# Altium schematic sheet StairMastersPDB.SchDoc
size 863 x 558 mm; SheetNumber: 1; SheetTotal: 1; SPICEModelCacheZXQFRXWD: <root> / <DocumentId>ZXQFRXWD</DocumentId> / </root>
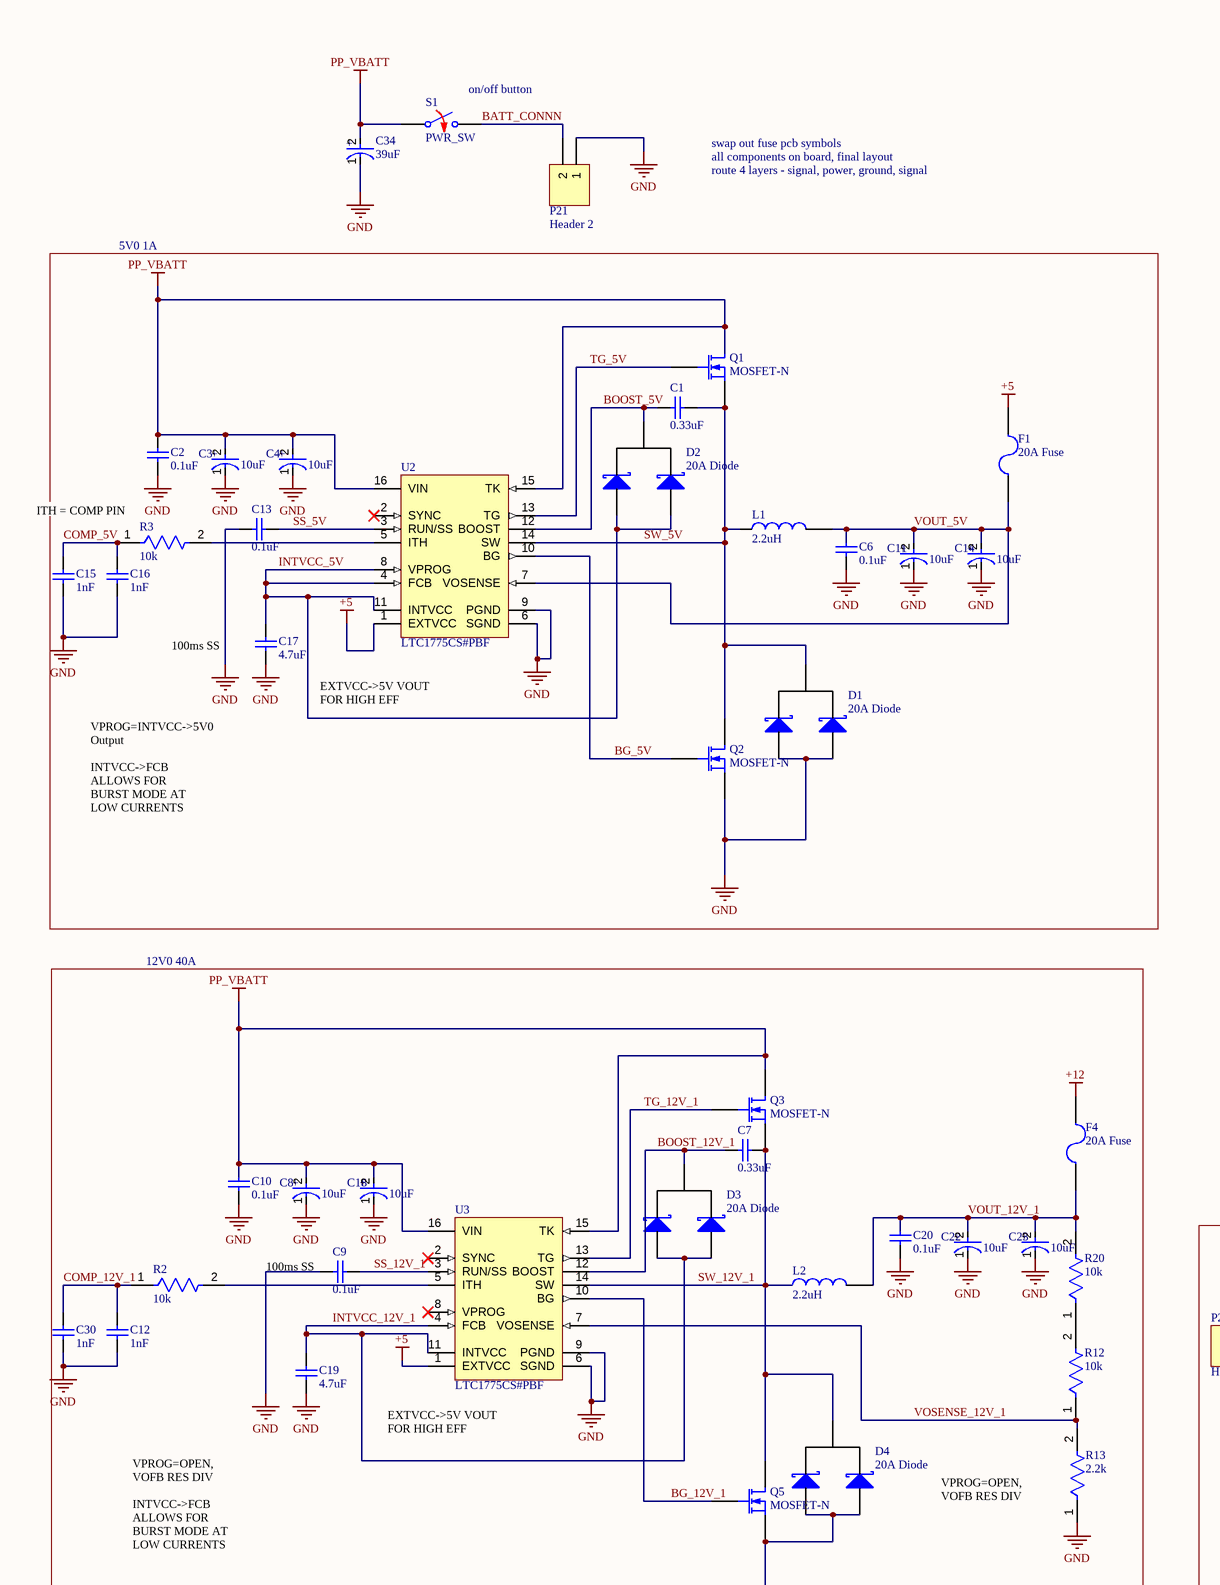
[diagram p0: StairMastersPDB.SchDoc, top left]
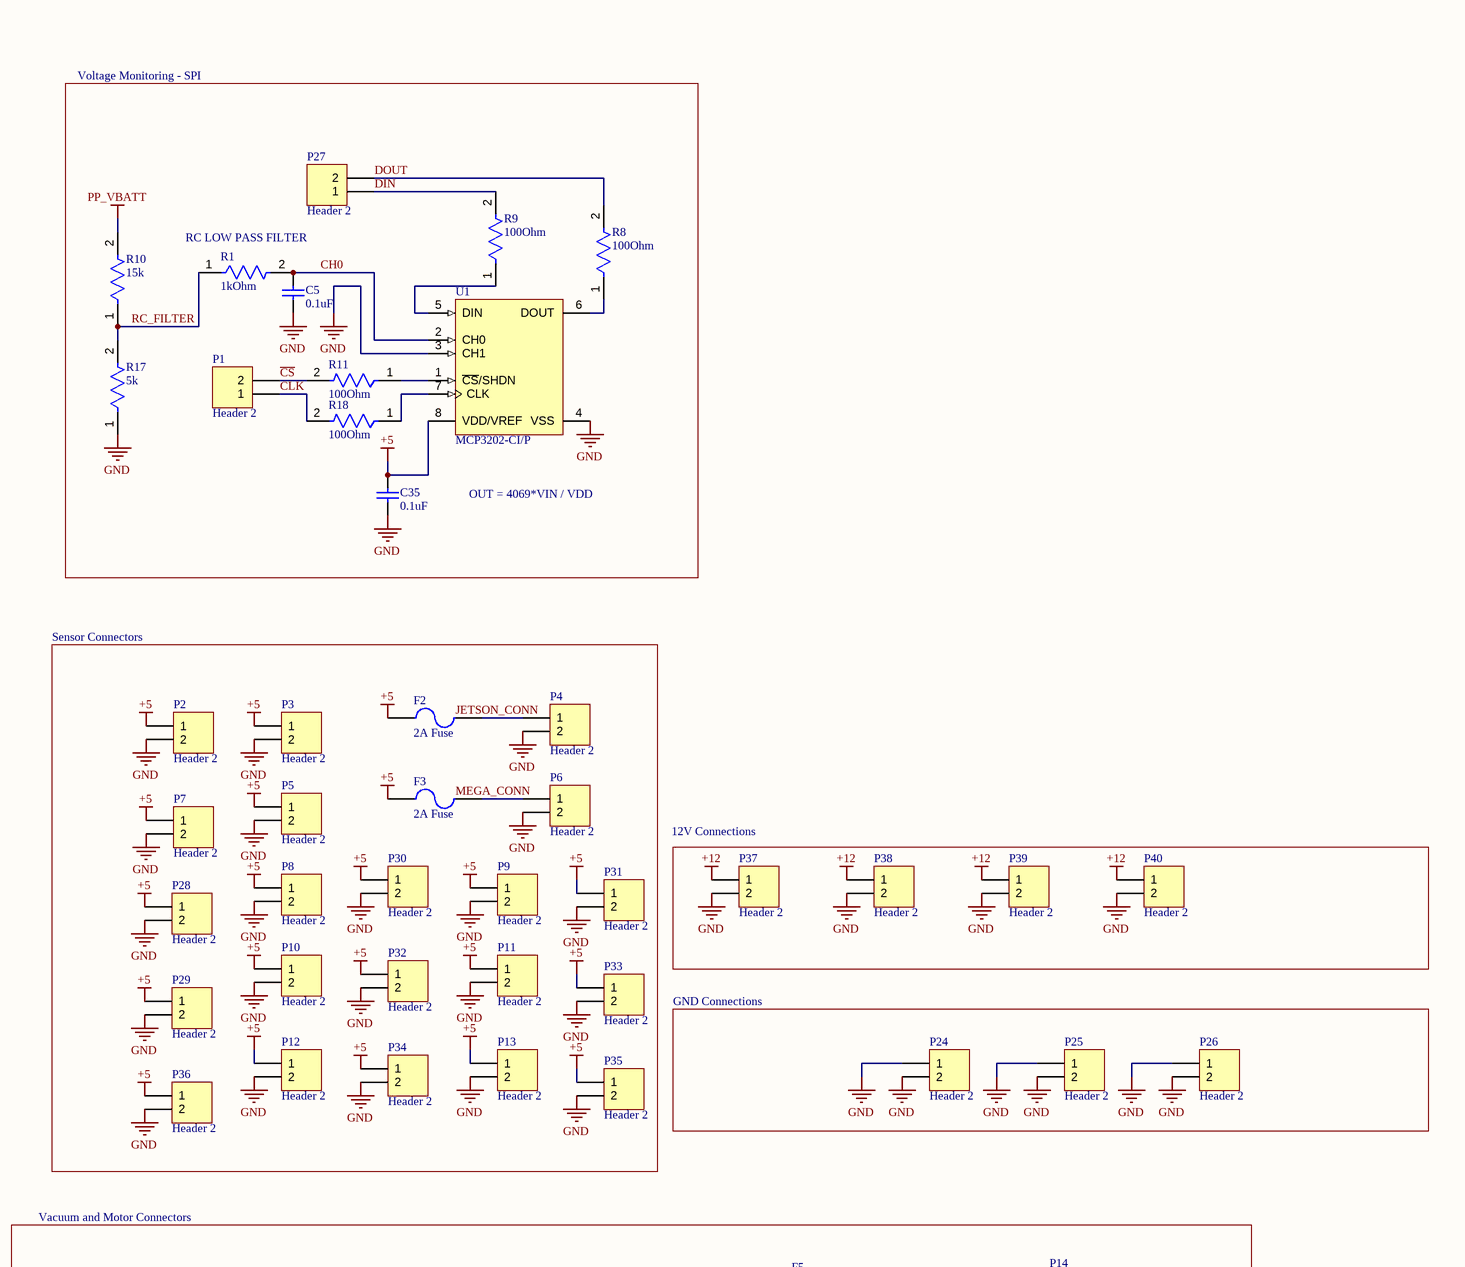
[diagram p1: StairMastersPDB.SchDoc, top right]
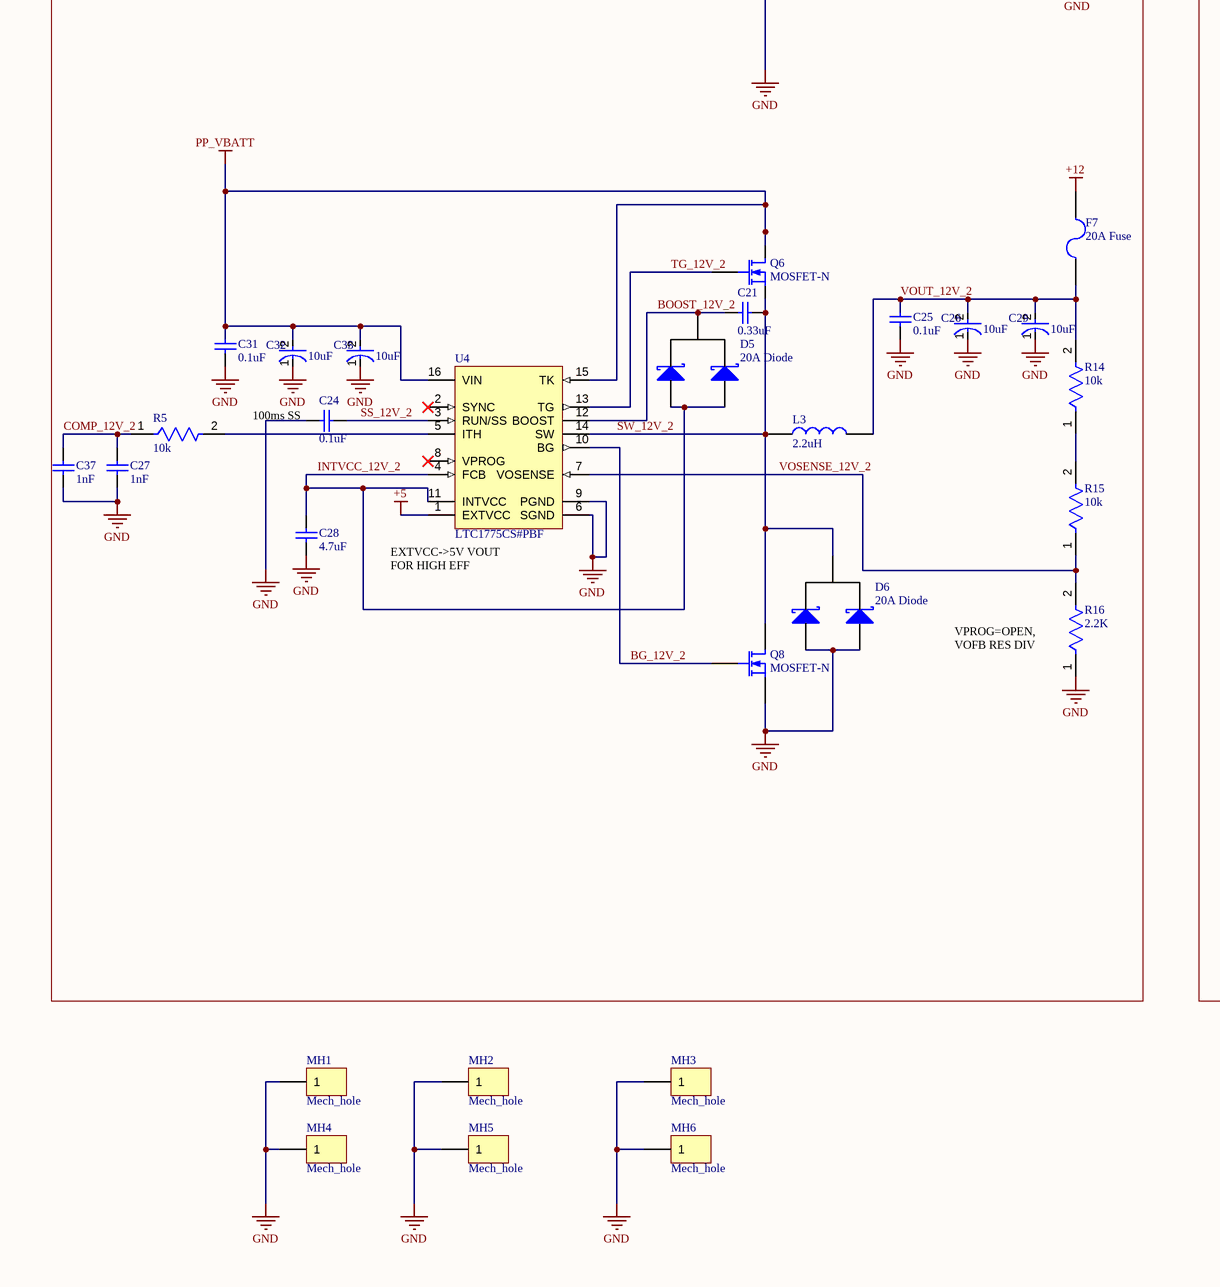
[diagram p2: StairMastersPDB.SchDoc, bottom left]
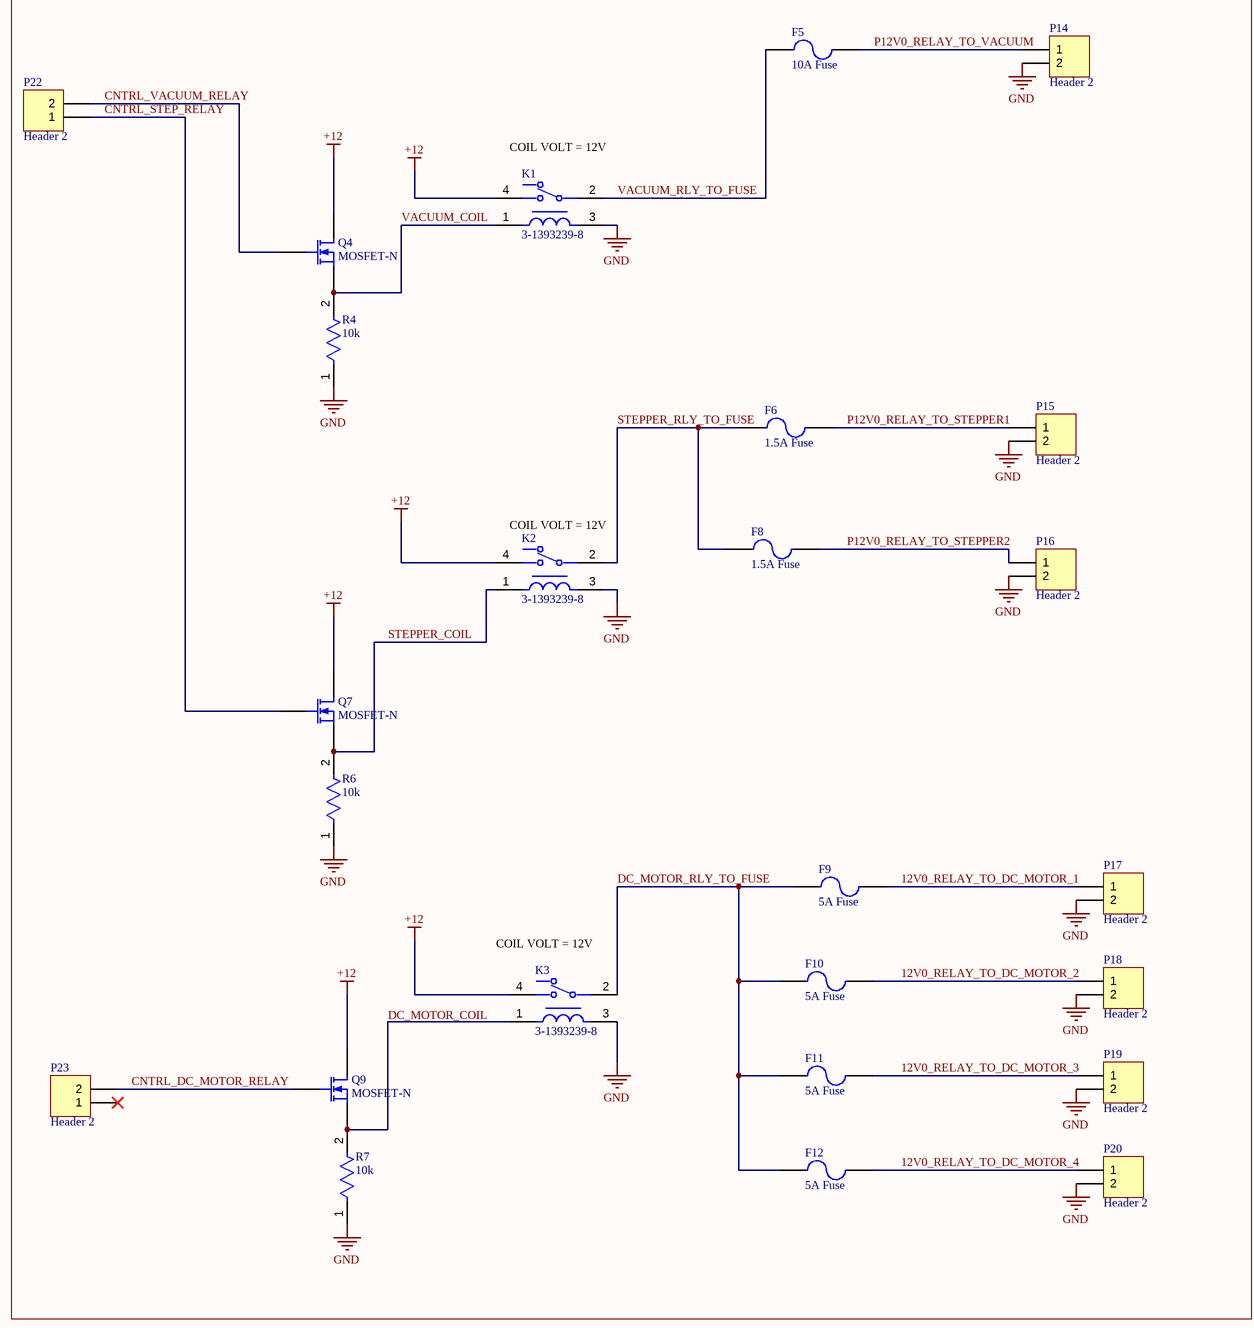
[diagram p3: StairMastersPDB.SchDoc, bottom right]

## Parts
C1  0.33uF  [VISH-K104K15X7RF5TL2]
C2  0.1uF  [VISH-K104K15X7RF5TL2]
C3  10uF  [FP-RAD-TH-D_5_0_5-L_11_1-MFG]
C4  10uF  [FP-RAD-TH-D_5_0_5-L_11_1-MFG]
C5  0.1uF  [VISH-K104K15X7RF5TL2]
C6  0.1uF  [VISH-K104K15X7RF5TL2]
C7  0.33uF  [VISH-K104K15X7RF5TL2]
C8  10uF  [FP-RAD-TH-D_5_0_5-L_11_1-MFG]
C9  0.1uF  [VISH-K104K15X7RF5TL2]
C10  0.1uF  [VISH-K104K15X7RF5TL2]
C11  10uF  [FP-RAD-TH-D_5_0_5-L_11_1-MFG]
C12  1nF  [VISH-K104K15X7RF5TL2]
C13  0.1uF  [VISH-K104K15X7RF5TL2]
C14  10uF  [FP-RAD-TH-D_5_0_5-L_11_1-MFG]
C15  1nF  [VISH-K104K15X7RF5TL2]
C16  1nF  [VISH-K104K15X7RF5TL2]
C17  4.7uF  [VISH-K104K15X7RF5TL2]
C18  10uF  [FP-RAD-TH-D_5_0_5-L_11_1-MFG]
C19  4.7uF  [VISH-K104K15X7RF5TL2]
C20  0.1uF  [VISH-K104K15X7RF5TL2]
C21  0.33uF  [VISH-K104K15X7RF5TL2]
C22  10uF  [FP-RAD-TH-D_5_0_5-L_11_1-MFG]
C23  10uF  [FP-RAD-TH-D_5_0_5-L_11_1-MFG]
C24  0.1uF  [VISH-K104K15X7RF5TL2]
C25  0.1uF  [VISH-K104K15X7RF5TL2]
C26  10uF  [FP-RAD-TH-D_5_0_5-L_11_1-MFG]
C27  1nF  [VISH-K104K15X7RF5TL2]
C28  4.7uF  [VISH-K104K15X7RF5TL2]
C29  10uF  [FP-RAD-TH-D_5_0_5-L_11_1-MFG]
C30  1nF  [VISH-K104K15X7RF5TL2]
C31  0.1uF  [VISH-K104K15X7RF5TL2]
C32  10uF  [FP-RAD-TH-D_5_0_5-L_11_1-MFG]
C33  10uF  [FP-RAD-TH-D_5_0_5-L_11_1-MFG]
C34  39uF  [polarized_radial_cap_TH]
C35  0.1uF  [VISH-K104K15X7RF5TL2]
C37  1nF  [VISH-K104K15X7RF5TL2]
D1  20A Diode  [DIODE-3-TH]
D2  20A Diode  [DIODE-3-TH]
D3  20A Diode  [DIODE-3-TH]
D4  20A Diode  [DIODE-3-TH]
D5  20A Diode  [DIODE-3-TH]
D6  20A Diode  [DIODE-3-TH]
F1  20A Fuse  [TH_RESISTOR]
F2  2A Fuse  [TH_RESISTOR]
F3  2A Fuse  [TH_RESISTOR]
F4  20A Fuse  [TH_RESISTOR]
F5  10A Fuse  [TH_RESISTOR]
F6  1.5A Fuse  [TH_RESISTOR]
F7  20A Fuse  [TH_RESISTOR]
F8  1.5A Fuse  [TH_RESISTOR]
F9  5A Fuse  [TH_RESISTOR]
F10  5A Fuse  [TH_RESISTOR]
F11  5A Fuse  [TH_RESISTOR]
F12  5A Fuse  [TH_RESISTOR]
K1  3-1393239-8  [PR12-12V-360-1A]
K2  3-1393239-8  [PR12-12V-360-1A]
K3  3-1393239-8  [PR12-12V-360-1A]
L1  2.2uH  [SRP1265WA2R2M]
L2  2.2uH  [SRP1265WA2R2M]
L3  2.2uH  [SRP1265WA2R2M]
MH1  Mech_hole  [Mounting Hole]
MH2  Mech_hole  [Mounting Hole]
MH3  Mech_hole  [Mounting Hole]
MH4  Mech_hole  [Mounting Hole]
MH5  Mech_hole  [Mounting Hole]
MH6  Mech_hole  [Mounting Hole]
P1  Header 2  [HDR1X2]
P2  Header 2  [HDR1X2]
P3  Header 2  [HDR1X2]
P4  Header 2  [HDR1X2]
P5  Header 2  [HDR1X2]
P6  Header 2  [HDR1X2]
P7  Header 2  [HDR1X2]
P8  Header 2  [HDR1X2]
P9  Header 2  [HDR1X2]
P10  Header 2  [HDR1X2]
P11  Header 2  [HDR1X2]
P12  Header 2  [HDR1X2]
P13  Header 2  [HDR1X2]
P14  Header 2  [HDR1X2]
P15  Header 2  [HDR1X2]
P16  Header 2  [HDR1X2]
P17  Header 2  [HDR1X2]
P18  Header 2  [HDR1X2]
P19  Header 2  [HDR1X2]
P20  Header 2  [HDR1X2]
P21  Header 2  [PWR_HDR1X2]
P22  Header 2  [HDR1X2]
P23  Header 2  [HDR1X2]
P24  Header 2  [HDR1X2]
P25  Header 2  [HDR1X2]
P26  Header 2  [HDR1X2]
P27  Header 2  [HDR1X2]
P28  Header 2  [HDR1X2]
P29  Header 2  [HDR1X2]
P30  Header 2  [HDR1X2]
P31  Header 2  [HDR1X2]
P32  Header 2  [HDR1X2]
P33  Header 2  [HDR1X2]
P34  Header 2  [HDR1X2]
P35  Header 2  [HDR1X2]
P36  Header 2  [HDR1X2]
P37  Header 2  [HDR1X2]
P38  Header 2  [HDR1X2]
P39  Header 2  [HDR1X2]
P40  Header 2  [HDR1X2]
Q1  MOSFET-N  [FET-3-TH]
Q2  MOSFET-N  [FET-3-TH]
Q3  MOSFET-N  [FET-3-TH]
Q4  MOSFET-N  [FET-3-TH]
Q5  MOSFET-N  [FET-3-TH]
Q6  MOSFET-N  [FET-3-TH]
Q7  MOSFET-N  [FET-3-TH]
Q8  MOSFET-N  [FET-3-TH]
Q9  MOSFET-N  [FET-3-TH]
R1  1kOhm  [FP-MRS25-MFG]
R2  10k  [FP-MBB0207-MFG]
R3  10k  [FP-MBB0207-MFG]
R4  10k  [FP-MBB0207-MFG]
R5  10k  [FP-MBB0207-MFG]
R6  10k  [FP-MBB0207-MFG]
R7  10k  [FP-MBB0207-MFG]
R8  100Ohm  [FP-MBB0207-MFG]
R9  100Ohm  [FP-MBB0207-MFG]
R10  15k  [FP-MBB0207-MFG]
R11  100Ohm  [FP-MBB0207-MFG]
R12  10k  [FP-MBB0207-MFG]
R13  2.2k  [FP-MBB0207-MFG]
R14  10k  [FP-MBB0207-MFG]
R15  10k  [FP-MBB0207-MFG]
R16  2.2K  [FP-MBB0207-MFG]
R17  5k  [FP-MBB0207-MFG]
R18  100Ohm  [FP-MBB0207-MFG]
R20  10k  [FP-MBB0207-MFG]
S1  PWR_SW  [PWR_HDR1X2]
U1  MCP3202-CI/P  [PDIP300-P8]
U2  LTC1775CS#PBF  [LT-S-16_M]
U3  LTC1775CS#PBF  [LT-S-16_M]
U4  LTC1775CS#PBF  [LT-S-16_M]

## Blocks framed on the sheet
5V0 1A: C1-C4 C6 C11 C13-C17 D1 D2 F1 L1 Q1 Q2 R3 U2
Sensor Connectors: F2 F3 P2-P13 P28-P36
12V Connections: P37-P40
12V0 40A: C7-C10 C12 C18-C33 C37 D3-D6 F4 F7 L2 L3 Q3 Q5 Q6 Q8 R2 R5 R12-R16 R20 U3 U4
GND Connections: P24-P26
Vacuum and Motor Connectors: F5 F6 F8-F12 K1-K3 P14-P20 P22 P23 Q4 Q7 Q9 R4 R6 R7

## Nets
+5: C35.2 F1.2 F2.1 F3.1 P2.1 P3.1 P5.1 P7.1 P8.1 P9.1 P10.1 P11.1 P12.1 P13.1 P28.1 P29.1 P30.1 P31.1 P32.1 P33.1 P34.1 P35.1 P36.1 U1.8(VDD/VREF) U2.1(EXTVCC) U3.1(EXTVCC) U4.1(EXTVCC)
+12: F4.2 F7.2 K1.4 K2.4 K3.4 P37.1 P38.1 P39.1 P40.1 Q4.1(D) Q7.1(D) Q9.1(D)
GND: C2.2 C3.1(C) C4.1(C) C5.1 C6.2 C8.1(C) C9.1 C10.2 C11.1(C) C12.2 C13.1 C14.1(C) C15.2 C16.2 C17.2 C18.1(C) C19.2 C20.2 C22.1(C) C23.1(C) C24.1 C25.2 C26.1(C) C27.1 C28.1 C29.1(C) C30.2 C31.2 C32.1(C) C33.1(C) C34.1(C) C35.1 C37.1 D1.1(A) D1.3(A) D4.1(A) D4.3(A) D6.1(A) D6.3(A) K1.3 K2.3 K3.3 MH1.1 MH2.1 MH3.1 MH4.1 MH5.1 MH6.1 P2.2 P3.2 P4.2 P5.2 P6.2 P7.2 P8.2 P9.2 P10.2 P11.2 P12.2 P13.2 P14.2 P15.2 P16.2 P17.2 P18.2 P19.2 P20.2 P21.1 P24.1 P24.2 P25.1 P25.2 P26.1 P26.2 P28.2 P29.2 P30.2 P31.2 P32.2 P33.2 P34.2 P35.2 P36.2 P37.2 P38.2 P39.2 P40.2 Q2.3(S) Q5.3(S) Q8.3(S) R4.1 R6.1 R7.1 R13.1 R16.1 R17.1 U1.3(CH1) U1.4(VSS) U2.6(SGND) U2.9(PGND) U3.6(SGND) U3.9(PGND) U4.6(SGND) U4.9(PGND)
PP_VBATT: C2.1 C3.2(A) C4.2(A) C8.2(A) C10.1 C18.2(A) C31.1 C32.2(A) C33.2(A) C34.2(A) Q1.1(D) Q3.1(D) Q6.1(D) R10.2 S1.1 U2.15(TK) U2.16(VIN) U3.15(TK) U3.16(VIN) U4.15(TK) U4.16(VIN)
12V0_RELAY_TO_DC_MOTOR_1: F9.2 P17.1
12V0_RELAY_TO_DC_MOTOR_2: F10.2 P18.1
12V0_RELAY_TO_DC_MOTOR_3: F11.2 P19.1
12V0_RELAY_TO_DC_MOTOR_4: F12.2 P20.1
~{CS}: P1.2 R11.2
BATT_CONNN: P21.2 S1.2
BG_5V: Q2.2(G) U2.10(BG)
BG_12V_1: Q5.2(G) U3.10(BG)
BG_12V_2: Q8.2(G) U4.10(BG)
BOOST_5V: C1.2 D2.2(K) U2.12(BOOST)
BOOST_12V_1: C7.1 D3.2(K) U3.12(BOOST)
BOOST_12V_2: C21.1 D5.2(K) U4.12(BOOST)
CH0: C5.2 R1.2 U1.2(CH0)
CLK: P1.1 R18.2
CNTRL_DC_MOTOR_RELAY: P23.2 Q9.2(G)
CNTRL_STEP_RELAY: P22.1 Q7.2(G)
CNTRL_VACUUM_RELAY: P22.2 Q4.2(G)
COMP_5V: C15.1 C16.1 R3.1
COMP_12V_1: C12.1 C30.1 R2.1
COMP_12V_2: C27.2 C37.2 R5.1
DC_MOTOR_COIL: K3.1 Q9.3(S) R7.2
DC_MOTOR_RLY_TO_FUSE: F9.1 F10.1 F11.1 F12.1 K3.2
DIN: P27.1 R9.2
DOUT: P27.2 R8.2
INTVCC_5V: C17.1 D2.1(A) D2.3(A) U2.4(FCB) U2.8(VPROG) U2.11(INTVCC)
INTVCC_12V_1: C19.1 D3.1(A) D3.3(A) U3.4(FCB) U3.11(INTVCC)
INTVCC_12V_2: C28.2 D5.1(A) D5.3(A) U4.4(FCB) U4.11(INTVCC)
P12V0_RELAY_TO_STEPPER1: F6.2 P15.1
P12V0_RELAY_TO_STEPPER2: F8.2 P16.1
P12V0_RELAY_TO_VACUUM: F5.2 P14.1
RC_FILTER: R1.1 R10.1 R17.2
SS_5V: C13.2 U2.3(RUN/SS)
SS_12V_1: C9.2 U3.3(RUN/SS)
SS_12V_2: C24.2 U4.3(RUN/SS)
STEPPER_COIL: K2.1 Q7.3(S) R6.2
STEPPER_RLY_TO_FUSE: F6.1 F8.1 K2.2
SW_5V: C1.1 D1.2(K) L1.1 Q1.3(S) Q2.1(D) U2.14(SW)
SW_12V_1: C7.2 D4.2(K) L2.1 Q3.3(S) Q5.1(D) U3.14(SW)
SW_12V_2: C21.2 D6.2(K) L3.1 Q6.3(S) Q8.1(D) U4.14(SW)
TG_5V: Q1.2(G) U2.13(TG)
TG_12V_1: Q3.2(G) U3.13(TG)
TG_12V_2: Q6.2(G) U4.13(TG)
VACUUM_COIL: K1.1 Q4.3(S) R4.2
VACUUM_RLY_TO_FUSE: F5.1 K1.2
VOSENSE_12V_1: R12.1 R13.2 U3.7(VOSENSE)
VOSENSE_12V_2: R15.1 R16.2 U4.7(VOSENSE)
VOUT_5V: C6.1 C11.2(A) C14.2(A) F1.1 L1.2 U2.7(VOSENSE)
VOUT_12V_1: C20.1 C22.2(A) C23.2(A) F4.1 L2.2 R20.2
VOUT_12V_2: C25.1 C26.2(A) C29.2(A) F7.1 L3.2 R14.2
NetF2_2: F2.2 P4.1
NetF3_2: F3.2 P6.1
NetR2_2: R2.2 U3.5(ITH)
NetR3_2: R3.2 U2.5(ITH)
NetR5_2: R5.2 U4.5(ITH)
NetR8_1: R8.1 U1.6(DOUT)
NetR9_1: R9.1 U1.5(DIN)
NetR11_1: R11.1 U1.1(~{CS}/SHDN)
NetR12_2: R12.2 R20.1
NetR14_1: R14.1 R15.2
NetR18_1: R18.1 U1.7(CLK)

Not connected (* = marked no-connect by the designer): P23 1*; U2 2(SYNC)*; U3 2(SYNC)* 8(VPROG)*; U4 2(SYNC)* 8(VPROG)*

## Notes on the sheet
- (near S1) on/off button
- Voltage Monitoring - SPI
- swap out fuse pcb symbols
- all components on board, final layout
- route 4 layers - signal, power, ground, signal
- RC LOW PASS FILTER
- OUT = 4069*VIN / VDD
- ITH = COMP PIN
- (near C17) 100ms SS
- EXTVCC->5V VOUT FOR HIGH EFF
- VPROG=INTVCC->5V0 Output
- INTVCC->FCB ALLOWS FOR BURST MODE AT LOW CURRENTS
- (near C9) 100ms SS
- (near U3) EXTVCC->5V VOUT FOR HIGH EFF
- (near K1) COIL VOLT = 12V
- VPROG=OPEN, VOFB RES DIV SETS VO
- (near R13) VPROG=OPEN, VOFB RES DIV SETS VO
- (near K2) COIL VOLT = 12V
- (near C24) 100ms SS
- (near U4) EXTVCC->5V VOUT FOR HIGH EFF
- (near K3) COIL VOLT = 12V
- (near R16) VPROG=OPEN, VOFB RES DIV SETS VO
- Labels drawn without touching a wire or pin: JETSON_CONN, MEGA_CONN
- DWG. NO.
- REV.
- SHT.
- REVISION
- DESCRIPTION
- DATE
- APPROVED
- THIS DOCUMENT AND THE DATA DISCLOSED HEREIN OR HEREWITH IS THE PROPERTY OF ALTIUM LIMITED AND MAY BE FREELY DISTRIBUTED IN WHOLE. NO RIGHTS ARE RESERVED OR EXPRESS OR IMPLIED WARANTEE GIVEN.
- ENG:
- DSN:
- APPROVALS
- PROJECT
- DOCUMENT REVISION:
- DESIGN ITEM:
- CHK:
- BOM:
- REFERENCE DOCUMENTS
- PROJECT REVISION:
- TITLE
- FAB DWG:
- PCB DWG:
- ASSY DWG:
- SCALE:
- SIZE
- D
- CAGE CODE
- FILE NAME
- DWG NO.
- SHEET
- OF
- REV
- (in symbol 39uF capacitor) +
- (in symbol CMP-05427-001989-1) +

## Library data of the parts
C1 C2 C5-C7 C9 C10 C12 C13 C15-C17 C19-C21 C24 C25 C27 C28 C30 C31 C35 C37 = CMP-2000-06508-1: Ceramic Capacitor, 100 nF, +/- 10%, 50 V, -55 to 125 degC, 2-Pin THD, RoHS, Tape and Reel; Manufacturer: Vishay; Other Names: BC1084CT; Catalog Drawings: Mono-KapSide2-15_5.58Mono-KapSide1_15; Temperature Coefficient: X7R; Voltage - Rated: 50V; Online Catalog: Mono-Kap™Series; Capacitance: 0.1µF; Size / Dimension: 0.157"Lx0.098"W(4.00mmx2.50mm); Operating Temperature: -55°C~125°C; Family: CeramicCapacitors; Manufacturer URL: http://www.vishay.com/; Standard Package: 1; Thickness (Max): -; Ratings: -; Datasheet Version: 08/2013; Package Description: 2-Pin Through Hole Device, Body 4 x 2.6 mm; Mounting Type: ThroughHole; Features: -; Lead Spacing: 0.098"(2.50mm); Tolerance: ±10%; Category: Capacitors; Mounting Technology: ThroughHole; Lead Style: Straight; Datasheet URL: http://www.vishay.com/docs/45171/kseries.pdf; Applications: GeneralPurpose; Package / Case: Radial; Height - Seated (Max): 0.220"(5.58mm); Package Reference: K104K15X7RF5TL2; Series: Mono-Kap™K; Packaging: CutTape(CT)
C3 C4 C8 C11 C14 C18 C22 C23 C26 C29 C32 C33 = CMP-05427-001989-1: Aluminum Electrolytic Capacitors (Radial Lead Type) AEC-Q200 Qualified 22uF ±20% 50V; Ripple Current: 155mA; Polarity: Polar; ESR (Equivalent Series Resistance): 1.3R; Life (Hours): 1000Hour; Leakage Current: 3uA; Lead Diameter: 0.5mm; Termination: Radial; Radiation Hardening: No; RoHS Compliant: Yes; Case/Package: Radial; Height: 11mm; Package Quantity: 2000; Min Operating Temperature: -55°C; Length: 11mm; Contact Plating: Tin; Series: FC; Voltage Rating: 50V; Diameter: 5mm; Capacitance: 22uF; Features: General Purpose; Max Operating Temperature: 105°C; Tolerance: 20%; Voltage Rating (DC): 50V; Mount: Through Hole; Impedance: 1.3R; Lead Pitch: 0.197inch; Packaging: Tape and Reel; Height - Seated (Max): 0.472inch
C34 = 39uF capacitor: Cap Aluminum 39uF 25V 20% (6.3 X 7mm) Radial 5mm 200mA 1000 hr 105C Ammo Pack; Manufacturer: Panasonic; Manufacturer Part Number: EEA-FC1E390B; Supplier: Mouser; Supplier Part Number: 667-EEA-FC1E390B; RoHS: Yes; Category: Aluminum Electrolytic Capacitors; Stock: 1295; Pricing: 1=0.47000, 10=0.32500, 50=0.22800, 100=0.19500, 1000=0.14700, 10000=0.11000 (USD); ComponentLink1URL: https://datasheet.ciiva.com/24234/aba0000ce22-68457-24234377.pdf?src-supplier=Mouser; ComponentLink1Description: https://datasheet.ciiva.com/24234/aba0000ce22-68457-24234377.pdf?src-supplier=Mouser; ComponentLink2URL: https://datasheet.ciiva.com/11680/aba0000ce22-11680271.pdf?src-supplier=Avnet; ComponentLink2Description: https://datasheet.ciiva.com/11680/aba0000ce22-11680271.pdf?src-supplier=Avnet
D1-D6 = 20A Diode: Manufacturer: Rohm; Manufacturer Part Number: RB215T-90NZC9; Supplier: Mouser; Supplier Part Number: 755-RB215T-90NZC9; RoHS: No; Stock: 1994; Pricing: 1=3.30000, 10=2.96000, 50=2.96000, 100=2.43000, 500=2.07000, 1000=1.74000, 2000=1.61000, 5000=1.59000, 10000=1.59000 (USD); ComponentLink1URL: http://datasheet.octopart.com/RB215T-90NZC9-Rohm-datasheet-142143394.pdf?src-supplier=Rs; ComponentLink1Description: http://datasheet.octopart.com/RB215T-90NZC9-Rohm-datasheet-142143394.pdf?src-supplier=Rs
F1 F4 F7 = 20A Fuse: Electric Fuse, Fast Blow, 20A, 1000A (IR), 3AB; Manufacturer: Littelfuse; Manufacturer Part Number: 0314020.MX52LEP; Pre-arcing Rating: 631A2/s; Rated Breaking Capacity: 1kA; Voltage Rating: 250V; Body Height: 31.75mm; Body Length or Diameter: 6.35mm; Reference Standard: UL; Supplier: Digi-Key; Supplier Part Number: 0314020.MX52LEP-ND; RoHS: Yes; Category: Fuses; Stock: 2925; Pricing: 1=1.59000, 5=1.54200, 10=1.44200, 50=1.19300, 100=0.99420, 250=0.96940, 500=0.82026, 1000=0.72083, 5000=0.64626 (USD); Terminal Finish: Nickel; Min Operating Temperature: -55°C; Max Operating Temperature: 125°C; Blow Characteristic: FAST; Circuit Protection Type: Electric Fuse; Fuse Size: 3AB; Current Rating: 20A; Termination: End Cap; Reach SVHC Compliant: Yes; RoHS Compliant: Yes; ComponentLink1URL: https://datasheet.ciiva.com:443/pdfs/VipMasterIC/IC/LFSI/LFSI-S-A0000790503/LFSI-S-A0000790503-1.pdf?src-supplier=IHS+Markit; ComponentLink1Description: https://datasheet.ciiva.com:443/pdfs/VipMasterIC/IC/LFSI/LFSI-S-A0000790503/LFSI-S-A0000790503-1.pdf?src-supplier=IHS+Markit; ComponentLink2URL: https://datasheet.ciiva.com/304/littelfuse-fuse-314p-324p-304224.pdf?src-supplier=Digi-Key; ComponentLink2Description: https://datasheet.ciiva.com/304/littelfuse-fuse-314p-324p-304224.pdf?src-supplier=Digi-Key
F2 F3 = 2A Fuse: Fuse Subminiature Very Fast Acting 2A 125V Axial 2.8 X 7.11mm Ceramic T/R; Manufacturer: Littelfuse; Manufacturer Part Number: 0251002.MRT1L; Circuit Protection Type: Electric Fuse; Fuse Class: Supplemental; Fuse Size: PICO; Joule-integral-Nom: 0.405J; Pre-arcing Rating: 0.405A2/s; Rated Breaking Capacity: 50A; Body Length or Diameter: 2.8mm; Reference Standard: UL; Supplier: Future Electronics; Supplier Part Number: 7081334; RoHS: Yes; Category: Fuses; Stock: 107000; Pricing: 1000=0.40000, 3000=0.39000, 5000=0.38500, 15000=0.37500, 25000=0.36500 (USD); Mounting Technology: Through Hole; Terminal Finish: Tin; Min Operating Temperature: -55°C; Max Operating Temperature: 125°C; JESD-609 Code: e3; Blow Characteristic: VERY FAST; Packaging: Tape and Reel; Current Rating: 2A; Voltage Rating: 125V; Voltage Rating (AC): 125V; Voltage Rating (DC): 125V; Termination: Pin Wire; Body Height: 7.11mm; RoHS Compliant: Yes; Reach SVHC Compliant: No; ComponentLink1URL: https://datasheet.ciiva.com:443/pdfs/VipMasterIC/IC/LFSI/LFSI-S-A0001360260/LFSI-S-A0001360260-1.pdf?src-supplier=IHS+Markit; ComponentLink1Description: https://datasheet.ciiva.com:443/pdfs/VipMasterIC/IC/LFSI/LFSI-S-A0001360260/LFSI-S-A0001360260-1.pdf?src-supplier=IHS+Markit; ComponentLink2URL: https://datasheet.ciiva.com/299/littelfuse-fuse-251-253-datasheet-pdf-299253.pdf?src-supplier=Digi-Key; ComponentLink2Description: https://datasheet.ciiva.com/299/littelfuse-fuse-251-253-datasheet-pdf-299253.pdf?src-supplier=Digi-Key; ComponentLink3URL: https://datasheet.ciiva.com/299/littelfuse-fuse-251-253-datasheet-pdf-299254.pdf?src-supplier=Digi-Key; ComponentLink3Description: https://datasheet.ciiva.com/299/littelfuse-fuse-251-253-datasheet-pdf-299254.pdf?src-supplier=Digi-Key; ComponentLink4URL: https://datasheet.ciiva.com/22658/88912-22658587.pdf?src-supplier=Element14; ComponentLink4Description: https://datasheet.ciiva.com/22658/88912-22658587.pdf?src-supplier=Element14; ComponentLink5URL: https://datasheet.ciiva.com/28363/88912-28363277.pdf?src-supplier=Element14; ComponentLink5Description: https://datasheet.ciiva.com/28363/88912-28363277.pdf?src-supplier=Element14; ComponentLink6URL: https://datasheet.ciiva.com/1548/251-253-1548974.pdf?src-supplier=Element14; ComponentLink6Description: https://datasheet.ciiva.com/1548/251-253-1548974.pdf?src-supplier=Element14; ComponentLink7URL: https://datasheet.ciiva.com/16328/251-253-16328168.pdf?src-supplier=Future+Electronics; ComponentLink7Description: https://datasheet.ciiva.com/16328/251-253-16328168.pdf?src-supplier=Future+Electronics; ComponentLink8URL: https://datasheet.ciiva.com/15187/getdatasheetpartid-116773-15187142.pdf?src-supplier=Verical; ComponentLink8Description: https://datasheet.ciiva.com/15187/getdatasheetpartid-116773-15187142.pdf?src-supplier=Verical; ComponentLink9URL: https://datasheet.ciiva.com/1681/88912-1681245.pdf?src-supplier=Farnell; ComponentLink9Description: https://datasheet.ciiva.com/1681/88912-1681245.pdf?src-supplier=Farnell
F5 = 10A Fuse: Fuse Subminiature Very Fast Acting 10A 125V Axial 2.8 X 7.11mm Ceramic Ammo Pack; Manufacturer: Littelfuse; Manufacturer Part Number: 0251010.HAT1L; Circuit Protection Type: Electric Fuse; Joule-integral-Nom: 25.5J; Rated Breaking Capacity: 50A; Body Length or Diameter: 2.8mm; Reference Standard: UL; Supplier: Future Electronics; Supplier Part Number: 9469693; RoHS: Yes; Category: Fuses; Stock: 1700; Pricing: 100=0.53000, 400=0.51000, 1500=0.49000, 4000=0.47500, 10000=0.45000 (USD); Mounting Technology: Through Hole; Terminal Finish: Tin; Min Operating Temperature: -55°C; Max Operating Temperature: 125°C; JESD-609 Code: e3; Blow Characteristic: VERY FAST; Packaging: Ammo Pack; Current Rating: 10A; Voltage Rating (AC): 125V; Voltage Rating (DC): 125V; Termination: Pin Wire; Body Height: 7.11mm; RoHS Compliant: Yes; Reach SVHC Compliant: No; ComponentLink1URL: https://datasheet.ciiva.com:443/pdfs/VipMasterIC/IC/LFSI/LFSI-S-A0001360260/LFSI-S-A0001360260-1.pdf?src-supplier=IHS+Markit; ComponentLink1Description: https://datasheet.ciiva.com:443/pdfs/VipMasterIC/IC/LFSI/LFSI-S-A0001360260/LFSI-S-A0001360260-1.pdf?src-supplier=IHS+Markit; ComponentLink2URL: https://datasheet.ciiva.com/303/littelfuse-fuse-251-253-datasheet-pdf-303888.pdf?src-supplier=Digi-Key; ComponentLink2Description: https://datasheet.ciiva.com/303/littelfuse-fuse-251-253-datasheet-pdf-303888.pdf?src-supplier=Digi-Key; ComponentLink3URL: https://datasheet.ciiva.com/29619/littelfuse-fuse-251-253-datasheet-pdf-29619034.pdf?src-supplier=Digi-Key; ComponentLink3Description: https://datasheet.ciiva.com/29619/littelfuse-fuse-251-253-datasheet-pdf-29619034.pdf?src-supplier=Digi-Key; ComponentLink4URL: https://datasheet.ciiva.com/29619/littelfuse-fuse-251-253-datasheet-pdf-29619033.pdf?src-supplier=Digi-Key; ComponentLink4Description: https://datasheet.ciiva.com/29619/littelfuse-fuse-251-253-datasheet-pdf-29619033.pdf?src-supplier=Digi-Key
F6 F8 = 1.5A Fuse: Fuse Subminiature Very Fast Acting 1.5A 125V Axial 2.8 X 7.11mm Ceramic T/R; Manufacturer: Littelfuse; Manufacturer Part Number: 025101.5MRT1L; Circuit Protection Type: Electric Fuse; Fuse Class: Supplemental; Fuse Size: PICO; Joule-integral-Nom: 0.587J; Pre-arcing Rating: 0.587A2/s; Rated Breaking Capacity: 50A; Body Length or Diameter: 2.8mm; Reference Standard: UL; Supplier: Future Electronics; Supplier Part Number: 7443534; RoHS: Yes; Category: Fuses; Stock: 160; Pricing: 1=0.69000, 10=0.59500, 40=0.54000, 150=0.48500, 500=0.44000 (USD); Mounting Technology: Through Hole; Terminal Finish: Tin; Min Operating Temperature: -55°C; Max Operating Temperature: 125°C; JESD-609 Code: e3; Blow Characteristic: VERY FAST; Packaging: Tape and Reel; Current Rating: 1.5A; Voltage Rating: 125V; Voltage Rating (AC): 125V; Voltage Rating (DC): 125V; Termination: Pin Wire; Body Height: 7.11mm; RoHS Compliant: Yes; Reach SVHC Compliant: No; ComponentLink1URL: https://datasheet.ciiva.com:443/pdfs/VipMasterIC/IC/LFSI/LFSI-S-A0001360260/LFSI-S-A0001360260-1.pdf?src-supplier=IHS+Markit; ComponentLink1Description: https://datasheet.ciiva.com:443/pdfs/VipMasterIC/IC/LFSI/LFSI-S-A0001360260/LFSI-S-A0001360260-1.pdf?src-supplier=IHS+Markit; ComponentLink2URL: https://datasheet.ciiva.com/28468/88912-28468542.pdf?src-supplier=Element14; ComponentLink2Description: https://datasheet.ciiva.com/28468/88912-28468542.pdf?src-supplier=Element14; ComponentLink3URL: https://datasheet.ciiva.com/301/littelfuse-fuse-251-253-datasheet-pdf-301635.pdf?src-supplier=Digi-Key; ComponentLink3Description: https://datasheet.ciiva.com/301/littelfuse-fuse-251-253-datasheet-pdf-301635.pdf?src-supplier=Digi-Key; ComponentLink4URL: https://datasheet.ciiva.com/301/littelfuse-fuse-251-253-datasheet-pdf-301634.pdf?src-supplier=Digi-Key; ComponentLink4Description: https://datasheet.ciiva.com/301/littelfuse-fuse-251-253-datasheet-pdf-301634.pdf?src-supplier=Digi-Key
F9-F12 = 5A Fuse: Electric Fuse, Very Fast Blow, 5A, 125VAC, 125VDC, 50A (IR), Through Hole; Manufacturer: Littelfuse; Manufacturer Part Number: 0251005.NAT1L; Joule-integral-Nom: 4.14J; Voltage Rating (AC): 125V; Body Height: 7.11mm; Body Length or Diameter: 2.8mm; Reference Standard: UL; Supplier: Newark; Supplier Part Number: 34AK3121; RoHS: Yes; Category: Fuses; Stock: 5000; Pricing: 10=0.72600, 25=0.64500, 50=0.56600, 100=0.48000, 500=0.40600, 1000=0.35800, 2500=0.32700 (USD); Mounting Technology: Through Hole; Terminal Finish: Tin; Min Operating Temperature: -55°C; Max Operating Temperature: 125°C; JESD-609 Code: e3; Blow Characteristic: VERY FAST; Circuit Protection Type: Electric Fuse; Packaging: Ammo Pack; Rated Breaking Capacity: 50A; Current Rating: 5A; Voltage Rating (DC): 125V; Termination: Pin Wire; Reach SVHC Compliant: Yes; RoHS Compliant: Yes; ComponentLink1URL: https://datasheet.ciiva.com:443/pdfs/VipMasterIC/IC/LFSI/LFSI-S-A0001360260/LFSI-S-A0001360260-1.pdf?src-supplier=IHS+Markit; ComponentLink1Description: https://datasheet.ciiva.com:443/pdfs/VipMasterIC/IC/LFSI/LFSI-S-A0001360260/LFSI-S-A0001360260-1.pdf?src-supplier=IHS+Markit; ComponentLink2URL: https://datasheet.ciiva.com/303/littelfuse-fuse-251-253-datasheet-pdf-303152.pdf?src-supplier=Digi-Key; ComponentLink2Description: https://datasheet.ciiva.com/303/littelfuse-fuse-251-253-datasheet-pdf-303152.pdf?src-supplier=Digi-Key; ComponentLink3URL: https://datasheet.ciiva.com/4492/251-253-45293-4492876.pdf?src-supplier=Mouser; ComponentLink3Description: https://datasheet.ciiva.com/4492/251-253-45293-4492876.pdf?src-supplier=Mouser; ComponentLink4URL: https://datasheet.ciiva.com/18670/littelfuse-fuse-251-253-datasheet-pdf-18670742.pdf?src-supplier=Digi-Key; ComponentLink4Description: https://datasheet.ciiva.com/18670/littelfuse-fuse-251-253-datasheet-pdf-18670742.pdf?src-supplier=Digi-Key; ComponentLink5URL: https://datasheet.ciiva.com/18670/littelfuse-fuse-251-253-datasheet-pdf-18670743.pdf?src-supplier=Digi-Key; ComponentLink5Description: https://datasheet.ciiva.com/18670/littelfuse-fuse-251-253-datasheet-pdf-18670743.pdf?src-supplier=Digi-Key
K1-K3 = PR12-12V-360-1A: RELAY GEN PURPOSE SPDT 10A 12V; Manufacturer: TE; Number Of Contacts: 1; Coil Resistance: 576Ω; Coil Power: 250mW; Coil Type: Non-Latching; RoHS: TRUE; Device Class L3: Power Relays; Ambient Temperature Range Low: -40°C; Device Class L2: Relays; Octopart: https://octopart.com/3-1393239-8-te+connectivity-40497687; Coil Voltage: 12V; Footprint Url: PB1688-ND; ComponentLink2URL: https://www.te.com/usa-en/product-3-1393239-8.html?te_bu=Cor&te_type=other&te_campaign=oct_glo_cor-oct-global-oth-prtnr-fy19-oct-octo-buy-bom_sma-298_2&elqCampaignId=35216; Automotive: No; ComponentLink2Description: Datasheet; Throw Configuration: SPDT; Mouser Description: General Purpose Relays RT174012; Height: 15.7mm; Digikey Description: RELAY GEN PURPOSE SPDT 10A 12V; Device Class L1: Electromechanical; Package: 3-1393239-8; Lead Free: Yes; Ambient Temperature Range High: +85°C; Manufacturer Part Number: 3-1393239-8; Category: Relay; Current Rating: 10A
L1-L3 = SRP1265WA-2R2M_1: 2.2 H Shielded Wirewound Inductor 22 A 4.2mOhm Max Nonstandard FIXED IND 2.2UH 22A 4.2 MOHM SMD 13.5x12.5x6.4; Manufacturer_Name: Bourns; Geometry.Height: 6.5mm; Mouser Part Number: 652-SRP1265WA-2R2M; Mouser Price/Stock: https://www.mouser.co.uk/ProductDetail/Bourns/SRP1265WA-2R2M?qs=Li%252BoUPsLEnvRcUJ534J08A%3D%3D; Manufacturer_Part_Number: SRP1265WA-2R2M; Datasheet Link: http://www.bourns.com/docs/Product-Datasheets/SRP1265WA.pdf
P1-P20 P22-P40 = Header 2: Header, 2-Pin; LatestRevisionDate: 17-Jul-2002; LatestRevisionNote: Re-released for DXP Platform.; Publisher: Altium Limited
P21 = PWR_CONN: Header, 2-Pin; LatestRevisionDate: 17-Jul-2002; LatestRevisionNote: Re-released for DXP Platform.; Publisher: Altium Limited
Q1-Q9 = MOSFET-N: N-Channel MOSFET; Published: 8-Jun-2000; LatestRevisionDate: 17-Jul-2002; LatestRevisionNote: Re-released for DXP Platform.; PackageVersion: 1995/1996; PackageReference: E3; Publisher: Altium Limited; PackageDescription: TO, Flat Index; 3 In-Line, Axial Leads; Body Dia. 4.6mm; Lead Dia. 0.5 mm (max)
R1 = CMP-02408-000051-1: RES 1K OHM 0.6W 1% AXIAL; Power Rating: 600mW; Lead Diameter: 0.6mm; Voltage Rating (DC): 350V; Resistance: 1kR; Temperature Coefficient: 50ppm/°C; Width: 2.5mm; Military Standard: Not; Package Quantity: 5000; Radiation Hardening: No; Case/Package: Axial; Resistance Tolerance: 1%; Resistor Type: Metal Film; Contact Plating: Tin; Length: 6.5mm; Lead Free: Lead Free; RoHS Compliant: Yes; Mount: Through Hole; Number of Pins: 2; Technology: THIN FILM; Voltage Rating: 350V; Min Operating Temperature: -55°C; Weight: 0.00776oz; Diameter: 2.5mm; Construction: Cylindrical; Series: MRS25; Tolerance: 1%; Packaging: Tape and Reel; Max Operating Temperature: 155°C; Max Power Dissipation: 600mW; Number of Terminations: 2; Termination: Axial
R2-R11 R17 R18 = CMP-02408-000035-1: RES 10K OHM 0.6W 1% AXIAL; Voltage Rating: 300V; Resistance: 10kR; Max Power Dissipation: 600mW; Temperature Coefficient: 50ppm/°C; Radiation Hardening: No; Case/Package: Conformal; Termination: Axial; Military Standard: Not; Length: 6.5mm; Voltage Rating (DC): 300V; RoHS Compliant: Yes; Number of Terminations: 2; Packaging: Tape and Reel; Features: Automotive AEC-Q200; Tolerance: 1%; Min Operating Temperature: -55°C; Power Rating: 600mW; Lead Free: Lead Free; Resistor Type: Metal Film; Construction: Cylindrical; Series: MBB 0207 - Professional; Max Operating Temperature: 155°C; Diameter: 2.5mm; Resistance Tolerance: 1%; Contact Plating: Tin; Technology: THIN FILM
R12 R14 R15 R20 = 100k Resistor: Fixed Resistor, Metal Film, 2W, 100000ohm, 500V, 5% +/-Tol, 250ppm/Cel, Through Hole Mount; Manufacturer: Vishay BCcomponents; Manufacturer Part Number: PR02000201003JA100; Rated Temperature: 70°C; Value: 100kR; Temperature Coefficient: 250ppm/°C; Package Length: 12mm; Lead Diameter: 0.78mm; Package Diameter: 3.9mm; Reference Standard: AEC-Q200; Supplier: Mouser; Supplier Part Number: 594-5083NW100K0JA100; RoHS: Yes; Category: Through-Hole Resistors; Stock: 11142; Pricing: 1=0.40000, 10=0.37000, 50=0.37000, 100=0.20900, 1000=0.08800, 10000=0.08800 (USD); Mounting Technology: Through Hole; Pins: 2; Terminal Finish: Tin; Package Shape: Tubular; Min Operating Temperature: -55°C; Max Operating Temperature: 155°C; Tolerance: 5%; Resistor Type: FIXED RESISTOR; Power: 2W; Technology: METAL FILM; Termination: Wire; Working Voltage: 500V; JESD-609 Code: e3; Construction: Tubular; Package Style: AxialMeter; Packaging: Ammo Pack; RoHS Compliant: Yes; Reach SVHC Compliant: Yes; ComponentLink1URL: https://datasheet.ciiva.com:443/pdfs/VipMasterIC/IC/VISH/VISH-S-A0005972021/VISH-S-A0005972021-1.pdf?src-supplier=IHS+Markit; ComponentLink1Description: https://datasheet.ciiva.com:443/pdfs/VipMasterIC/IC/VISH/VISH-S-A0005972021/VISH-S-A0005972021-1.pdf?src-supplier=IHS+Markit; ComponentLink2URL: https://datasheet.ciiva.com/11824/0900766b80d9a182-11824802.pdf?src-supplier=Rs; ComponentLink2Description: https://datasheet.ciiva.com/11824/0900766b80d9a182-11824802.pdf?src-supplier=Rs; ComponentLink3URL: https://datasheet.ciiva.com/48426/pr01-02-03-eng-tds-48426207.pdf?src-supplier=Distrelec; ComponentLink3Description: https://datasheet.ciiva.com/48426/pr01-02-03-eng-tds-48426207.pdf?src-supplier=Distrelec
R13 R16 = 11k Resistor: Fixed Resistor, Metal Film, 0.4W, 11000ohm, 350V, 1% +/-Tol, 50ppm/Cel, Through Hole Mount; Manufacturer: Vishay Semiconductors; Manufacturer Part Number: MBB02070C1102FC100; Power: 400mW; Rated Temperature: 70°C; Value: 11kR; Temperature Coefficient: 50ppm/°C; Additional Feature: RATED AC VOLTAGE: 350V; Lead Diameter: 0.6mm; Package Diameter: 2.5mm; Package Length: 6.5mm; Lead Length: 28mm; Reference Standard: AEC-Q200; Supplier: Mouser; Supplier Part Number: 594-MBB02070C1102FC1; RoHS: Yes; Category: Through-Hole Resistors; Stock: 999; Pricing: 1=0.40000, 10=0.30800, 50=0.30800, 100=0.13000, 500=0.09400, 1000=0.07100, 2000=0.06600, 10000=0.06600 (USD); Mounting Technology: Through Hole; Pins: 2; Terminal Finish: Nickel; Min Operating Temperature: -55°C; Max Operating Temperature: 125°C; Tolerance: 1%; Resistor Type: FIXED RESISTOR; Technology: THIN FILM; Termination: Wire; Working Voltage: 350V; JESD-609 Code: e3; Construction: Tubular; Package Style: AxialMeter; Packaging: Ammo Pack; Reach SVHC Compliant: Yes; RoHS Compliant: Yes; ComponentLink1URL: https://datasheet.ciiva.com:443/pdfs/VipMasterIC/IC/VISH/VISH-S-A0005972005/VISH-S-A0005972005-1.pdf?src-supplier=IHS+Markit; ComponentLink1Description: https://datasheet.ciiva.com:443/pdfs/VipMasterIC/IC/VISH/VISH-S-A0005972005/VISH-S-A0005972005-1.pdf?src-supplier=IHS+Markit; ComponentLink2URL: http://components.arrow.com/part/dataview/44454635S9668648N4052?src-supplier=Arrow+Electronics; ComponentLink2Description: http://components.arrow.com/part/dataview/44454635S9668648N4052?src-supplier=Arrow+Electronics; ComponentLink3URL: http://www.vishay.com/docs/28766/28766.pdf?src-supplier=Avnet; ComponentLink3Description: http://www.vishay.com/docs/28766/28766.pdf?src-supplier=Avnet
U1 = CMP-0188-00238-2: 2.7V Dual Channel 12-Bit A/D Converter with SPI Serial Interface, 8-Pin PDIP, C Performance Grade, Industrial Temperature; ComponentLink3Description: Package Specification; ComponentLink1URL: http://www.microchip.com/; PackageDescription: 8-Lead Plastic Dual In-Line (P) - 300 mil Body [PDIP]; ComponentLink1Description: Manufacturer URL; RevisionNote: URLs added. DatasheetVersion updated.; DatasheetVersion: revF, Nov-2011; PackageVersion: revBB, Aug-2009; PackageReference: PDIP300-P8; ComponentLink3URL: http://www.microchip.com/stellent/groups/techpub_sg/documents/packagingspec/en012702.pdf; Code_JEDEC: MS-001; ComponentLink2URL: http://ww1.microchip.com/downloads/en/DeviceDoc/21034F.pdf; ComponentLink2Description: Datasheet
U2-U4 = CMP-0492-01609-1: High Power No Rsense(TM) Current Mode Synchronous Step-Down Switching Regulator, 16-pin SOP (S-16), 0 to 70 degC, Pb-Free; Manufacturer: Linear Technology; Number of Outputs: 1; Frequency Sync Range: 150kHz - 225kHz; PackageVersion: Rev. G, 05/2012; PartNumber: LTC1775CS#PBF; RoHS: TRUE; ComponentLink2Description: Datasheet; ComponentLink1Description: Manufacturer URL; ComponentLink3URL: http://cds.linear.com/docs/en/packaging/S16%2005-08-1610%20Rev%20G.pdf; ComponentLink2URL: http://cds.linear.com/docs/en/datasheet/1775f.pdf; PackageDescription: 16-Pin Plastic Small Outline, Body 9.9 x 3.9 mm, Pitch 1.27 mm; ComponentLink3Description: Package Specification; PackageReference: S-16; ComponentLink1URL: http://www.linear.com/; Mounting Technology: Surface Mount